# Altium schematic sheet Breakout.SchDoc
size A4; SheetNumber: 4; SheetTotal: 4
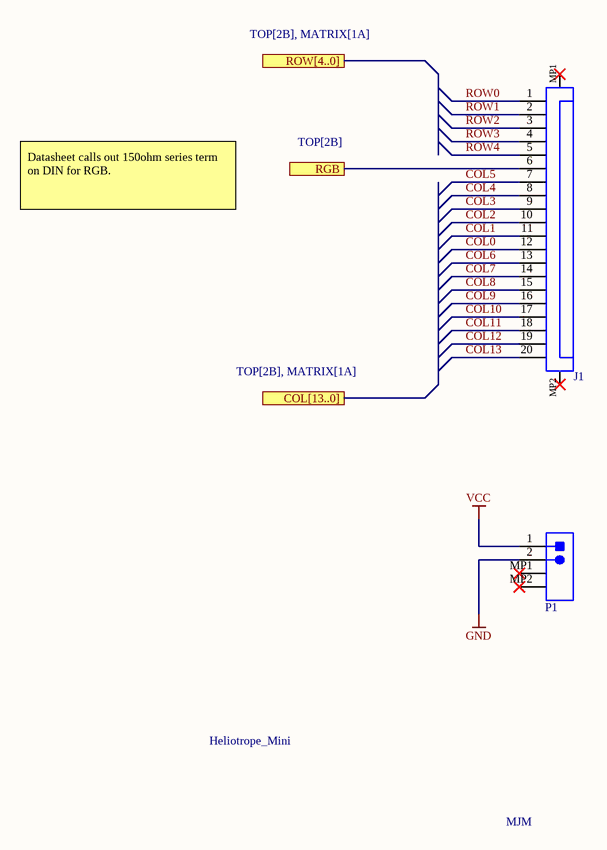
[diagram p0: Breakout.SchDoc]

## Parts
J1  68712014522  [68712014522]  (value not drawn)
P1  53261-0271  [MOLX-53261-0271_V]  (value not drawn)

## Ports
COL[13..0] (see TOP[2B], MATRIX[1A]), RGB (see TOP[2B]), ROW[4..0] (see TOP[2B], MATRIX[1A])

## Nets
GND: P1.2
VCC: P1.1
COL0: J1.12
COL1: J1.11
COL2: J1.10
COL3: J1.9
COL4: J1.8
COL5: J1.7
COL6: J1.13
COL7: J1.14
COL8: J1.15
COL9: J1.16
COL10: J1.17
COL11: J1.18
COL12: J1.19
COL13: J1.20
RGB: J1.6 ; port RGB
ROW0: J1.1
ROW1: J1.2
ROW2: J1.3
ROW3: J1.4
ROW4: J1.5

Not connected (* = marked no-connect by the designer): J1 MP1* MP2*; P1 MP1* MP2*

## Notes on the sheet
- Datasheet calls out 150ohm series term on DIN for RGB.
- Heliotrope_Mini
- MJM

## Library data of the parts
J1 = CMP-00003-2: Ffc / Fpc Board Connector, Zif, Surface Mount, Plug, 20, Bottom, 0.5 Mm Rohs Compliant: Yes; MF: Wurth Electronics; SnapEDA_Link: https://www.snapeda.com/parts/68712014522/Wurth+Electronics+Inc./view-part/?ref=snap; Design Item ID: 68712014522; Purchase-URL: https://pricing.snapeda.com/search/part/68712014522/?ref=eda; Pin Count: 20; Package: None; Value: *; Availability: In Stock; MP: 68712014522; Component Type: Standard; Price: None; Source: 68712014522.SchLib; Check_prices: https://www.snapeda.com/parts/68712014522/Wurth+Electronics+Inc./view-part/?ref=eda
P1 = CMP-042-000002-1: 1.25mm Pitch PicoBlade™ Header, Surface Mount, Right Angle, Lead-Free, 2 Circuits